# Altium schematic sheet Lipo_Saver.SchDoc
size A4; Author: Audran; CompanyName: Goldorak; Address1: Electrolab; Address2: 52 rue Paul Lescop; Address3: 92000 Nanterre; DocumentNumber: 1; SheetNumber: 1; SheetTotal: 5; ProjectName: Cartes_2017
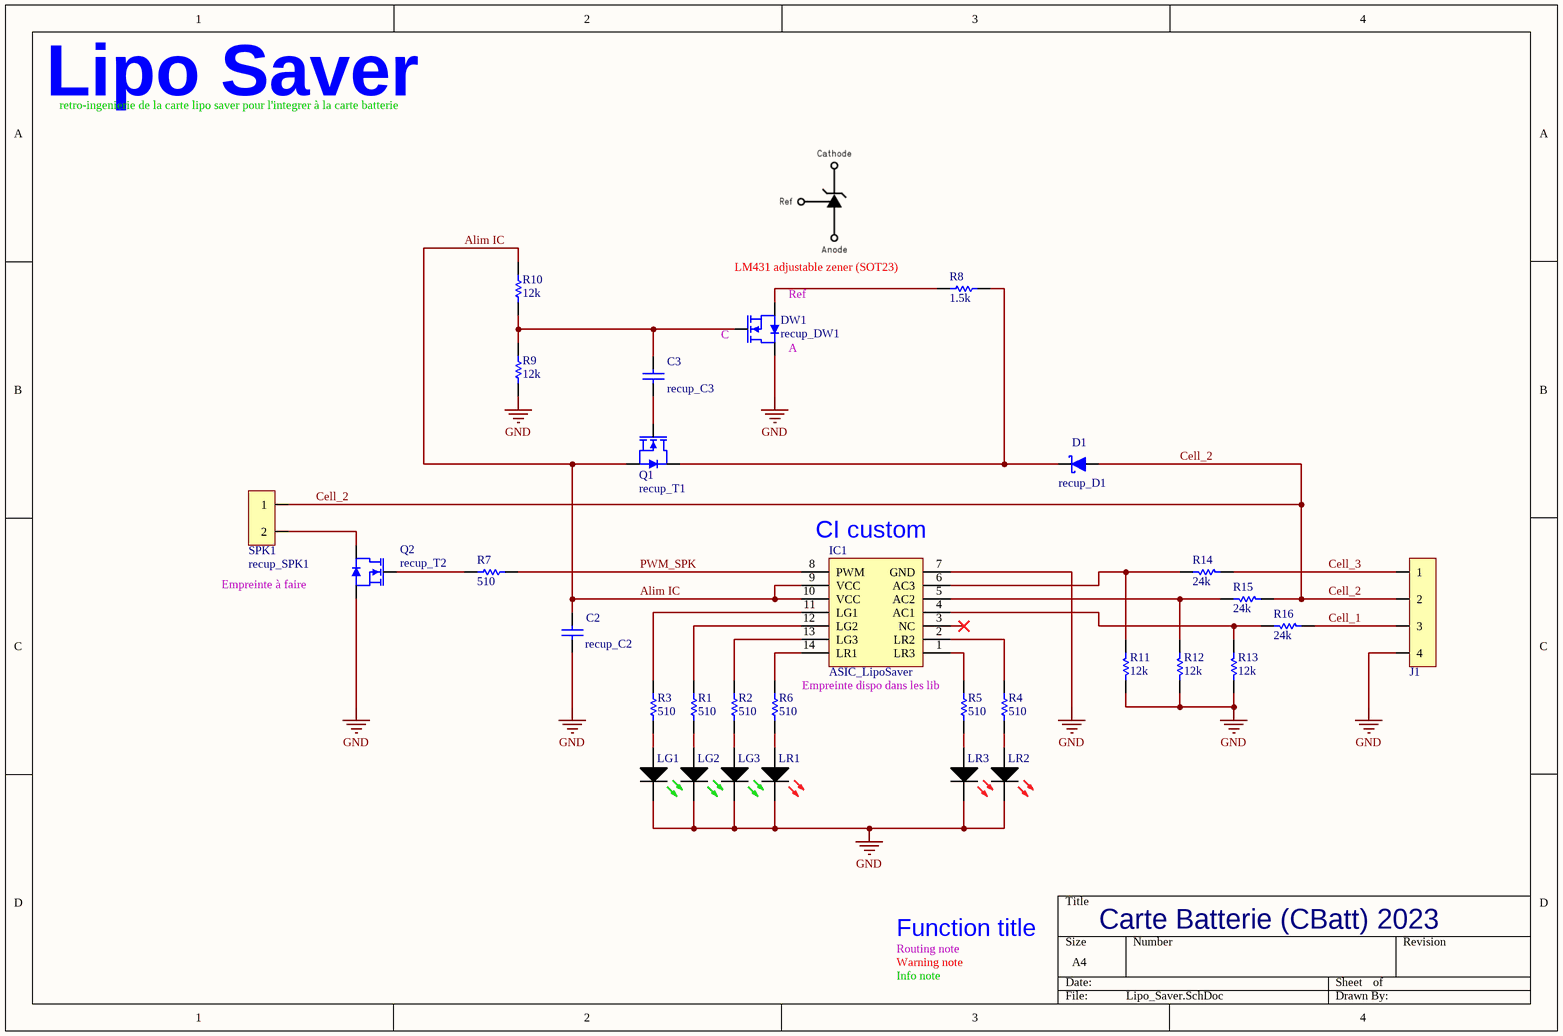
[diagram p0: Lipo_Saver.SchDoc]

## Parts
C2  recup_C2  [WCAP-CSGP_0805, 2x1.25x1.25]
C3  recup_C3  [WCAP-CSGP_0603, 1.6x0.8x0.8]
D1  recup_D1  [SOD-123FL]
DW1  recup_DW1  [SOT-23]
IC1  ASIC_LipoSaver  [SOIC127P600X175-14N]
J1  22-03-2041  [Conn_22-03-2041]  (value not drawn)
LG1  150060GS75000  [SMCW_0603]  (value not drawn)
LG2  150060GS75000  [SMCW_0603]  (value not drawn)
LG3  150060GS75000  [SMCW_0603]  (value not drawn)
LR1  150060RS75000  [SMCW_0603]  (value not drawn)
LR2  150060RS75000  [SMCW_0603]  (value not drawn)
LR3  150060RS75000  [SMCW_0603]  (value not drawn)
Q1  recup_T1  [SOT-23]
Q2  recup_T2  [SOT-23]
R1  value 510  [RESC1608X06N]  (hidden comment: RC0603FR-07100KL)
R2  value 510  [RESC1608X06N]  (hidden comment: RC0603FR-07100KL)
R3  value 510  [RESC1608X06N]  (hidden comment: RC0603FR-07100KL)
R4  value 510  [RESC1608X06N]  (hidden comment: RC0603FR-07100KL)
R5  value 510  [RESC1608X06N]  (hidden comment: RC0603FR-07100KL)
R6  value 510  [RESC1608X06N]  (hidden comment: RC0603FR-07100KL)
R7  value 510  [RESC1608X06N]  (hidden comment: RC0603FR-07100KL)
R8  value 1.5k  [RESC1608X06N]  (hidden comment: RC0603FR-07100KL)
R9  value 12k  [RESC1608X06N]  (hidden comment: RC0603FR-07100KL)
R10  value 12k  [RESC1608X06N]  (hidden comment: RC0603FR-07100KL)
R11  value 12k  [RESC1608X06N]  (hidden comment: RC0603FR-07100KL)
R12  value 12k  [RESC1608X06N]  (hidden comment: RC0603FR-07100KL)
R13  value 12k  [RESC1608X06N]  (hidden comment: RC0603FR-07100KL)
R14  value 24k  [RESC1608X06N]  (hidden comment: RC0603FR-07100KL)
R15  value 24k  [RESC1608X06N]  (hidden comment: RC0603FR-07100KL)
R16  value 24k  [RESC1608X06N]  (hidden comment: RC0603FR-07100KL)
SPK1  recup_SPK1  [22-03-2021]

## Nets
GND: C2.1 DW1.3(D) IC1.7(GND) J1.4 LG1.1(C) LG2.1(C) LG3.1(C) LR1.1(C) LR2.1(C) LR3.1(C) Q2.2(S) R9.2 R11.1 R12.1 R13.1
Alim IC: C2.2 IC1.9(VCC) IC1.10(VCC) Q1.2(S) R10.2
Cell_1: J1.3 R16.2
Cell_2: D1.1 J1.2 R15.2 SPK1.1
Cell_3: J1.1 R14.2
PWM_SPK: IC1.8(PWM) R7.1
NetC3_1: C3.1 Q1.1(G)
NetC3_2: C3.2 DW1.1(G) R9.1 R10.1
NetD1_2: D1.2 Q1.3(D) R8.1
NetDW1_2: DW1.2(S) R8.2
NetIC1_1: IC1.1(LR3) R5.1
NetIC1_2: IC1.2(LR2) R4.1
NetIC1_4: IC1.4(AC1) R13.2 R16.1
NetIC1_5: IC1.5(AC2) R12.2 R15.1
NetIC1_6: IC1.6(AC3) R11.2 R14.1
NetIC1_11: IC1.11(LG1) R3.1
NetIC1_12: IC1.12(LG2) R1.1
NetIC1_13: IC1.13(LG3) R2.1
NetIC1_14: IC1.14(LR1) R6.1
NetLG1_2: LG1.2(A) R3.2
NetLG2_2: LG2.2(A) R1.2
NetLG3_2: LG3.2(A) R2.2
NetLR1_2: LR1.2(A) R6.2
NetLR2_2: LR2.2(A) R4.2
NetLR3_2: LR3.2(A) R5.2
NetQ2_1: Q2.1(G) R7.2
NetQ2_3: Q2.3(D) SPK1.2

Not connected (* = marked no-connect by the designer): IC1 3(NC)*

## Notes on the sheet
- Lipo Saver
- retro-ingenierie de la carte lipo saver pour l'integrer à la carte batterie
- LM431 adjustable zener (SOT23)
- (near DW1) Ref
- (near DW1) C
- (near DW1) A
- (near IC1) CI custom
- Empreinte à faire
- (near R5) Empreinte dispo dans les lib
- Routing note
- Warning note
- Info note
- Function title
- Carte Batterie (CBatt) 2023

## Library data of the parts
C2 = WCAP-CSGP, 885012207103: CAP CER 1uF 50V X7R 0805; Manufacturer: Wurth Elektronik; ComponentLink1Description: Datasheet; ComponentLink1URL: http://katalog.we-online.com/pbs/datasheet/885012207103.pdf; Manufacturer Part Number: 885012207103; Value: 1uF; Size: 0805; CeramicType: X7R; Supplier 2: JLCPCB; Supplier Part Number 2: C28323; RatedVoltage: 50V; Supplier Footprint 2: 0805; Supplier 1: Farnell; Supplier Part Number 1: 2495200
C3 = WCAP-CSGP, 885012206095: CAP CER 100nF 50V X7R 0603; Manufacturer: Wurth Elektronik; ComponentLink1Description: Datasheet; ComponentLink1URL: http://katalog.we-online.com/pbs/datasheet/885012206095.pdf; Value: 100nF; Size: 0603; CeramicType: X7R; RatedVoltage: 50V; Manufacturer Part Number: 885012206095; Supplier 2: JLCPCB; Supplier Part Number 2: C14663; Supplier Footprint 2: 0603
D1 = RBR3MM40ATFTR: DIODE SCHOTTKY 40V 3A SOD123-FL; Manufacturer: ROHM; Supplier 1: Farnell; Manufacturer Part Number: RBR3MM40ATFTR; ComponentLink1URL: http://www.farnell.com/datasheets/2067190.pdf; ComponentLink1Description: Datasheet; Supplier Part Number 1: 2581593; ComponentLink2Description: Manufacturer; ComponentLink2URL: http://www.rohm.com/web/global/products/-/product/RBR3MM40ATF; ContinuousForwardCurrent: 3A; Type: Schottky; Supplier 2: JLCPCB; Supplier Part Number 2: C8598; Value: 40V; Supplier Footprint 2: SOD-123
DW1 Q1 Q2 = 2N7002: MOSFET N 60V 115MA SOT23; Manufacturer: Changjiang Electronics Tech (CJ); Manufacturer Part Number: 2N7002; ComponentLink1Description: Datasheet; ComponentLink1URL: https://datasheet.lcsc.com/szlcsc/1810151612_Changjiang-Electronics-Tech-CJ-2N7002_C8545.pdf; Supplier 2: JLCPCB; Supplier Part Number 2: C8545; Supplier 1: Farnell; Supplier Part Number 1: 1510761; Supplier Footprint 2: SOT-23-3
IC1 = ASIC_LipoSaver: Specific IC for Lipo Saver (extracted; Manufacturer: LipoSaver; ComponentLink1URL: https://www.onsemi.com/pdf/datasheet/74vhc02-d.pdf; ComponentLink1Description: Datasheet; Manufacturer Part Number: ASIC_LipoSaver
J1 = Conn_22-03-2041: CONN HEADER VERT 4POS 2.54MM; Manufacturer: MOLEX; Manufacturer Part Number: 22-03-2041; Supplier 1: Farnell; Supplier Part Number 1: 9731091; ComponentLink1Description: Datasheet; ComponentLink1URL: https://www.molex.com/pdm_docs/sd/022032041_sd.pdf
LG1-LG3 = WL-SMCW 0603  150060GS75000: SMD mono-color Chip LED, WL-SMCW, Green; Manufacturer: Wurth Elektronik; Value: Vert; Manufacturer Part Number: 150060GS75000; ComponentLink1Description: Datasheet; ComponentLink1URL: http://katalog.we-online.com/led/datasheet/150060GS75000.pdf; Supplier 1: Farnell; Supplier Part Number 1: 2322070; Supplier 2: JLCPCB; Supplier Part Number 2: C72043; Supplier Footprint 2: LED_0603
LR1-LR3 = WL-SMCW 0603  150060RS75000: SMD mono-color Chip LED, WL-SMCW, Red; Manufacturer: Wurth Elektronik; Value: Rouge; Manufacturer Part Number: 150060RS75000; ComponentLink1Description: Datasheet; ComponentLink1URL: http://katalog.we-online.com/led/datasheet/150060RS75000.pdf; Supplier 1: Farnell; Supplier Part Number 1: 2322071; Supplier 2: JLCPCB; Supplier Part Number 2: C2286; Supplier Footprint 2: LED_0603
R1-R16 = RC0603FR-07100KL: RES SMD 100K OHM 1% 1/10W 0603; Manufacturer: Yageo; Power: 100mW; Vmax: 50V; Manufacturer Part Number: RC0603FR-07100KL; Type: Thick Film; ComponentLink1Description: Manufacturer; ComponentLink1URL: http://www.yageo.com/NewPortal/_en/index.jsp; ComponentLink2Description: Datasheet; ComponentLink2URL: http://www.farnell.com/datasheets/2167052.pdf; Supplier 1: Farnell; Supplier Part Number 1: 2309107; Precision: ±1%; Supplier 2: JLCPCB; Supplier Part Number 2: C25803; Supplier Footprint 2: 0603
SPK1 = 22-03-2021: CONN HEADER VERT 2POS 2.54MM; Manufacturer: MOLEX; Supplier 1: Farnell; Supplier Part Number 1: 9731075; Manufacturer Part Number: 22-03-2021; ComponentLink1URL: http://www.farnell.com/datasheets/1791308.pdf; ComponentLink1Description: Datasheet; ComponentLink2URL: http://www.farnell.com/cad/495071.pdf  http://www.farnell.com/cad/1533907.pdf  http://www.farnell.com/cad/1533907.pdf; ComponentLink2Description: Drawings